# EAGLE design Akkucheck (EAGLE 7.3.0)
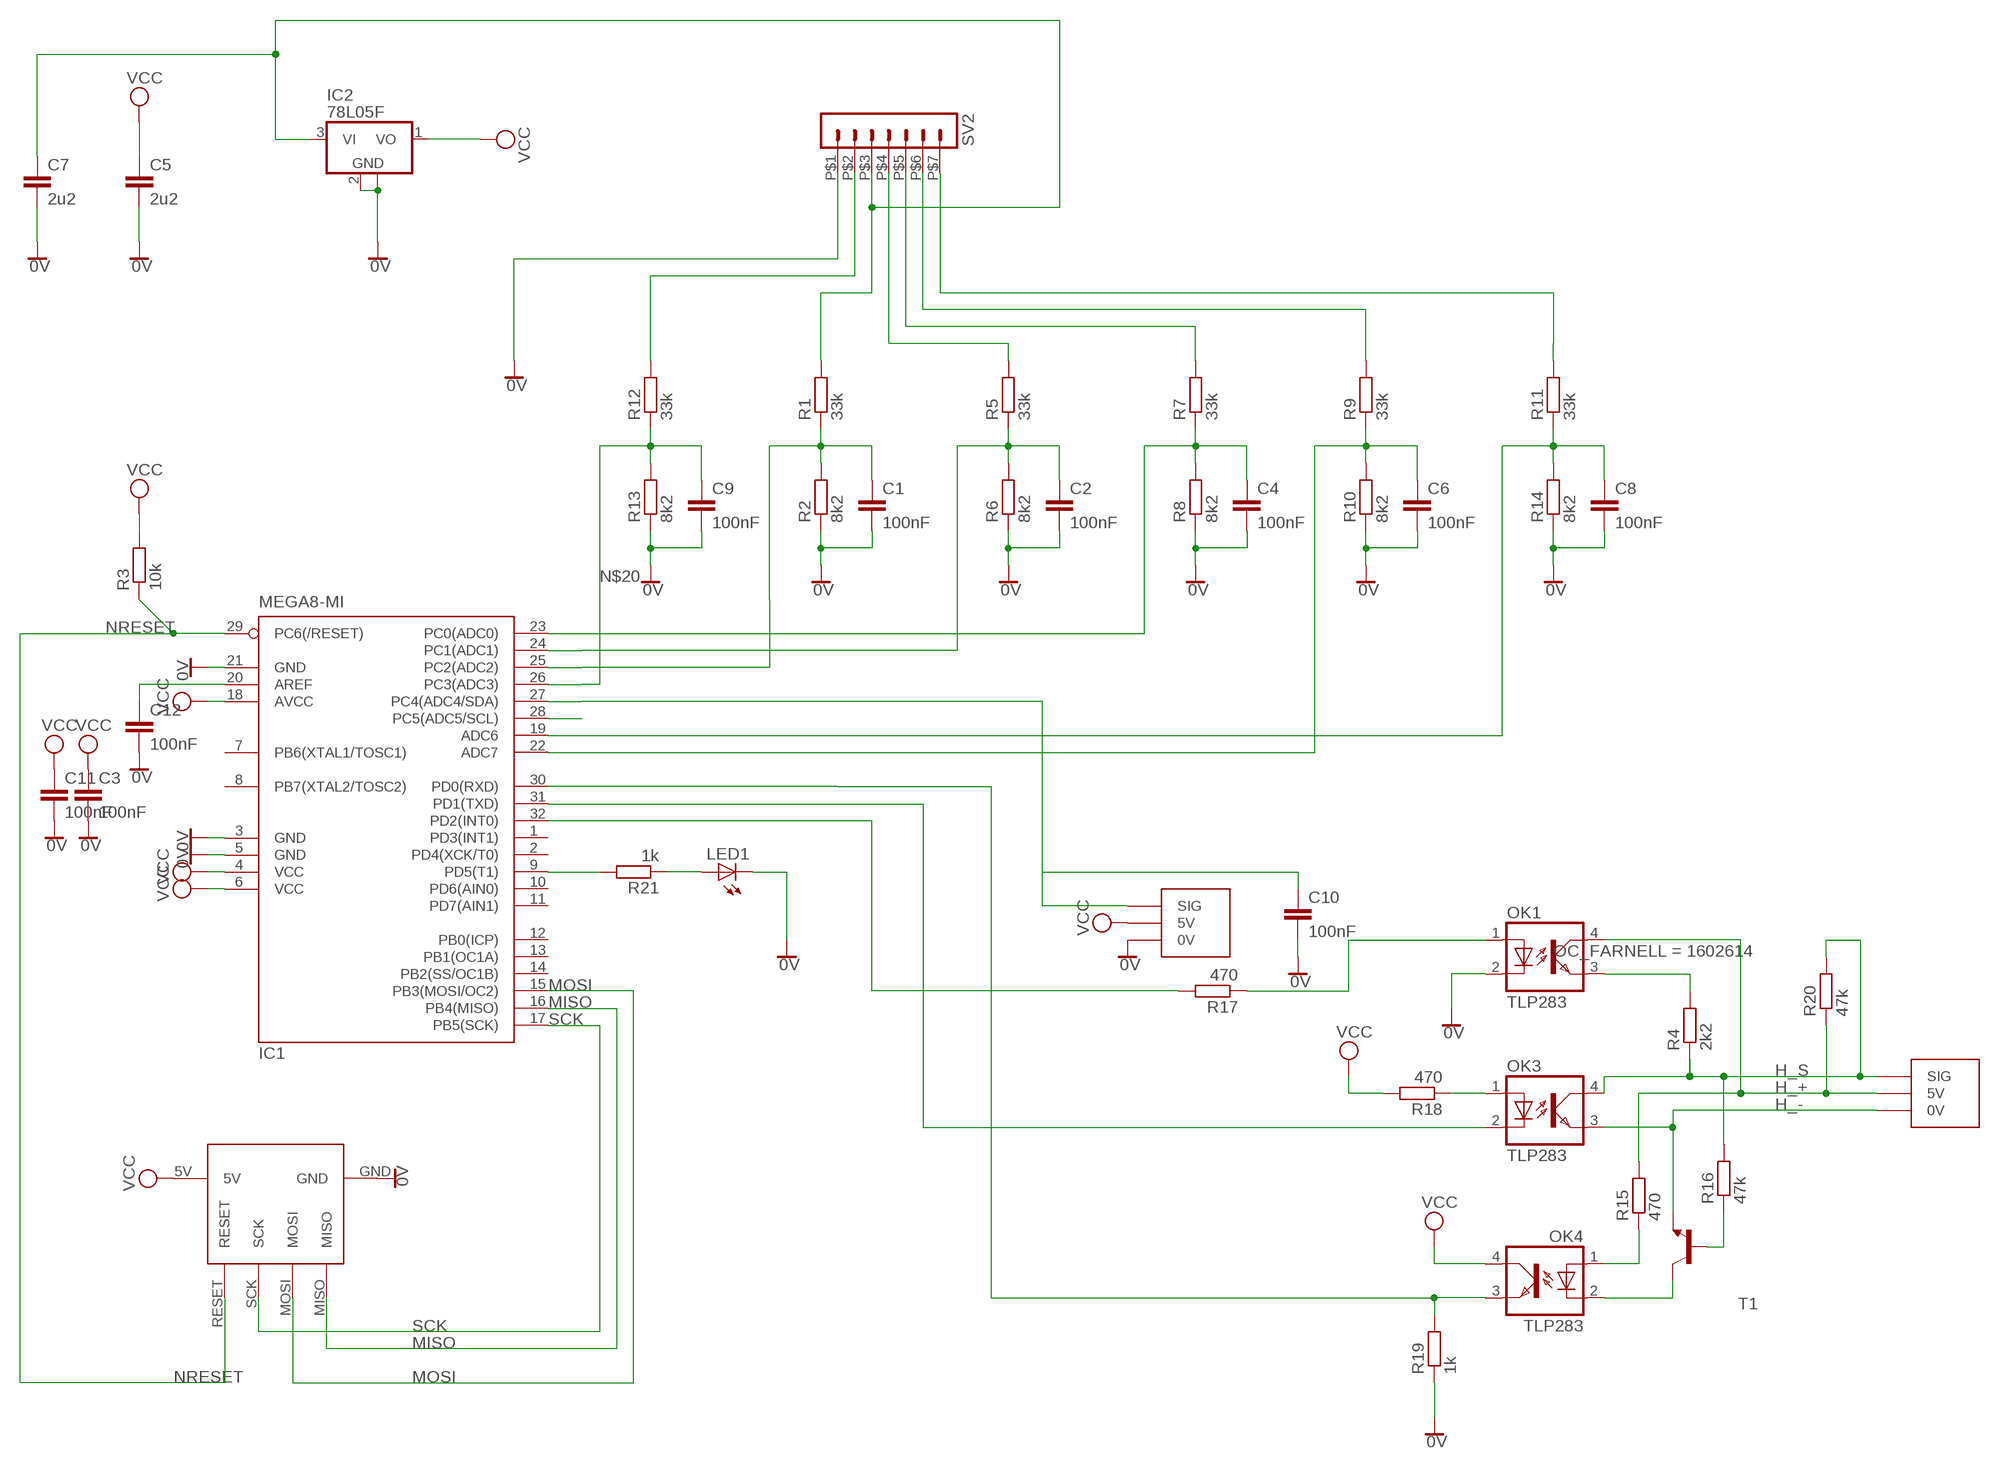
[diagram p0: schematic, sheet 1]

## Parts
C1  100nF  C-EUC0402  [C0402]
C2  100nF  C-EUC0402  [C0402]
C3  100nF  C-EUC0402  [C0402]
C4  100nF  C-EUC0402  [C0402]
C5  2u2  C-EUC0805  [C0805]
C6  100nF  C-EUC0402  [C0402]
C7  2u2  C-EUC0805  [C0805]
C8  100nF  C-EUC0402  [C0402]
C9  100nF  C-EUC0402  [C0402]
C10  100nF  C-EUC0402  [C0402]
C11  100nF  C-EUC0402  [C0402]
C12  100nF  C-EUC0402  [C0402]
IC1  MEGA8-MI  [MLF32]
IC2  78L05F  [SOT89]
IN1  3-WIRE_CONNWIRE  [3WIRE_CONN]
IN3  3-WIRE_CONNWIRE  [3WIRE_CONN]
LED1  LEDCHIPLED_0603  [CHIPLED_0603]
OK1  TLP283  [MINI-FLAT-4]
OK3  TLP283  [MINI-FLAT-4]
OK4  TLP283  [MINI-FLAT-4]
R1  33k  R-EU_R0402  [R0402]
R2  8k2  R-EU_R0402  [R0402]
R3  10k  R-EU_R0402  [R0402]
R4  2k2  R-EU_R0402  [R0402]
R5  33k  R-EU_R0402  [R0402]
R6  8k2  R-EU_R0402  [R0402]
R7  33k  R-EU_R0402  [R0402]
R8  8k2  R-EU_R0402  [R0402]
R9  33k  R-EU_R0402  [R0402]
R10  8k2  R-EU_R0402  [R0402]
R11  33k  R-EU_R0402  [R0402]
R12  33k  R-EU_R0402  [R0402]
R13  8k2  R-EU_R0402  [R0402]
R14  8k2  R-EU_R0402  [R0402]
R15  470  R-EU_R0402  [R0402]
R16  47k  R-EU_R0402  [R0402]
R17  470  R-EU_R0402  [R0402]
R18  470  R-EU_R0402  [R0402]
R19  1k  R-EU_R0402  [R0402]
R20  47k  R-EU_R0402  [R0402]
R21  1k  R-EU_R0402  [R0402]
SV2  MA07-1_SMD  [MA07-1_SMD]
T1  BC817-16-NPN-SOT23-BEC  [SOT23-BEC]
U$1  ISPSMD  [ISP_SMD]

## Nets
0V: C1.2 C2.2 C3.2 C4.2 C5.2 C6.2 C7.2 C8.2 C9.2 C10.2 C11.2 C12.2 IC1.3(GND) IC1.5(GND) IC1.21(GND) IC2.2(GND) IC2.2@1(GND) IN1.0V LED1.C OK1.2(C) R2.1 R6.1 R8.1 R10.1 R13.1 R14.1 R19.1 SV2.P$1 U$1.GND
H_+ [isol]: IN3.5V OK1.4(COL) R15.2 R20.1
H_- [isol]: IN3.0V OK3.3(EMIT) T1.E
H_S [isol]: IN3.SIG OK3.4(COL) R4.1 R16.2 R20.2
MISO: IC1.16(PB4(MISO)) U$1.MISO
MOSI: IC1.15(PB3(MOSI/OC2)) U$1.MOSI
N$1 [supp]: R12.2 SV2.P$2
N$2: C6.1 IC1.22(ADC7) R9.1 R10.2
N$3 [supp]: R5.2 SV2.P$4
N$4 [supp]: R7.2 SV2.P$5
N$5 [supp]: R9.2 SV2.P$6
N$6: C10.1 IC1.27(PC4(ADC4/SDA)) IN1.SIG
N$7 [supp]: C7.1 IC2.3(VI) R1.2 SV2.P$3
N$8: C8.1 IC1.19(ADC6) R11.1 R14.2
N$9: LED1.A R21.1
N$10: IC1.9(PD5(T1)) R21.2
N$11 [isol]: OK1.3(EMIT) R4.2
N$12 [isol]: OK4.1(A) R15.1
N$13 [isol]: OK4.2(C) T1.C
N$15: C1.1 IC1.25(PC2(ADC2)) R1.1 R2.2
N$16: C2.1 IC1.24(PC1(ADC1)) R5.1 R6.2
N$18: IC1.30(PD0(RXD)) OK4.3(EMIT) R19.2
N$19: IC1.31(PD1(TXD)) OK3.2(C)
N$20: C9.1 IC1.26(PC3(ADC3)) R12.1 R13.2
N$22 [isol]: R16.1 T1.B
N$23: OK3.1(A) R18.1
N$24: IC1.32(PD2(INT0)) R17.2
N$25: OK1.1(A) R17.1
N$26: C12.1 IC1.20(AREF)
N$27 [supp]: R11.2 SV2.P$7
N$28: IC1.28(PC5(ADC5/SCL))
N$33: C4.1 IC1.23(PC0(ADC0)) R7.1 R8.2
NRESET: IC1.29(PC6(/RESET)) R3.1 U$1.RESET
SCK: IC1.17(PB5(SCK)) U$1.SCK
VCC: C3.1 C5.1 C11.1 IC1.4(VCC) IC1.6(VCC) IC1.18(AVCC) IC2.1(VO) IN1.5V OK4.4(COL) R3.2 R18.2 U$1.5V
Unconnected: IC1.1(PD3(INT1)) IC1.2(PD4(XCK/T0)) IC1.7(PB6(XTAL1/TOSC1)) IC1.8(PB7(XTAL2/TOSC2)) IC1.10(PD6(AIN0)) IC1.11(PD7(AIN1)) IC1.12(PB0(ICP)) IC1.13(PB1(OC1A)) IC1.14(PB2(SS/OC1B))

## Library data of the parts
C1-C4 C6 C8-C12 = rcl:C-EU: CAPACITOR, European symbol; MF: AVX; MPN: 04023C104KAT2A; OC_FARNELL: 1867948
C5 C7 = rcl:C-EU: CAPACITOR, European symbol; MF: MULTICOMP; MPN: MC0805B225K250CT; OC_FARNELL: 2320829
IC1 = atmel:MEGA8: MICROCONTROLLER 8 Kbytes FLASH, 1 kbytes SRAM, 512 bytes EEPROM, USART, 6-channel 10 bit ADC, 2-channel 8 bit ADC Pin compatible with Atmega48, ATMega88, ATMega168 Source: avr.lbr; MF: ATMEL; MPN: ATMEGA88PA-MU; OC_FARNELL: 1715491; OC_NEWARK: 15R0272
IC2 = linear:78L*: POSITOIV-VOLTAGE REGULATORS Output up to 100 mA Source: http://focus.ti.com/lit/ds/symlink/ua78l05.pdf; MF: STMICROELECTRONICS; MPN: L78L05ABUTR; OC_FARNELL: 1467762
IN1 IN3 = Fabi:3-WIRE_CONN; OC_FARNELL: unknown
LED1 = led:LED: LED OSRAM: - CHIPLED LG R971, LG N971, LY N971, LG Q971, LY Q971, LO R971, LY R971 LH N974, LH R974 LS Q976, LO Q976, LY Q976 LO Q996 - Hyper CHIPLED LW Q18S LB Q993, LB Q99A, LB R99A - SideLED LS A670, LO A670, LY A670, LG A670, LP A670 LB A673, LV A673, LT A673, LW A673 LH A674 LY A675 LS A676, LA A676, LO A676, LY A676, LW A676 LS A679, LY A679, LG A679 - Hyper Micro SIDELED® LS Y876, LA Y876, LO Y876, LY Y876 LT Y87S - SmartLED LW L88C, LW L88S LB L89C, LB L89S, LG L890 LS L89K, LO L89K, LY L89K LS L896, LA L896, LO L896, LY L896 - TOPLED LS T670, LO T670, LY T670, LG T670, LP T670 LSG T670, LSP T670, LSY T670, LOP T670, LYG T670 LG T671, LOG T671, LSG T671 LB T673, LV T673, LT T673, LW T673 LH T674 LS T676, LA T676, LO T676, LY T676, LB T676, LH T676, LSB T676, LW T676 LB T67C, LV T67C, LT T67C, LS T67K, LO T67K, LY T67K, LW E67C LS E67B, LA E67B, LO E67B, LY E67B, LB E67C, LV E67C, LT E67C LW T67C LS T679, LY T679, LG T679 LS T770, LO T770, LY T770, LG T770, LP T770 LB T773, LV T773, LT T773, LW T773 LH T774 LS E675, LA E675, LY E675, LS T675 LS T776, LA T776, LO T776, LY T776, LB T776 LHGB T686 LT T68C, LB T68C - Hyper Mini TOPLED® LB M676 - Mini TOPLED Santana® LG M470 LS M47K, LO M47K, LY M47K Source: http://www.osram.convergy.de LUXEON: - LUMILED® LXK2-PW12-R00, LXK2-PW12-S00, LXK2-PW14-U00, LXK2-PW14-V00 LXK2-PM12-R00, LXK2-PM12-S00, LXK2-PM14-U00 LXK2-PE12-Q00, LXK2-PE12-R00, LXK2-PE12-S00, LXK2-PE14-T00, LXK2-PE14-U00 LXK2-PB12-K00, LXK2-PB12-L00, LXK2-PB12-M00, LXK2-PB14-N00, LXK2-PB14-P00, LXK2-PB14-Q00 LXK2-PR12-L00, LXK2-PR12-M00, LXK2-PR14-Q00, LXK2-PR14-R00 LXK2-PD12-Q00, LXK2-PD12-R00, LXK2-PD12-S00 LXK2-PH12-R00, LXK2-PH12-S00 LXK2-PL12-P00, LXK2-PL12-Q00, LXK2-PL12-R00 Source: www.luxeon.com KINGBRIGHT: KA-3528ASYC Source: www.kingbright.com; OC_FARNELL: unknown
OK1 OK3 OK4 = optocoupler:TLP283: TOSHIBA PHOTOCOUPLER GaAs IRED & PHOTO-TRANSISTOR Source: http://www.semicon.toshiba.co.jp/td/en/Opto/Photocoupler/en_20050928_TLP283_datasheet.pdf; MF: AVAGO TECHNOLOGIES; MPN: ACPL-217-500E; OC_FARNELL: 1602614; OC_NEWARK: unknown
R1 R5 R7 R9 R11 R12 = rcl:R-EU_: RESISTOR, European symbol; MF: TE CONNECTIVITY; MPN: CRG0402F33K; OC_FARNELL: 2331513
R2 R6 R8 R10 R13 R14 = rcl:R-EU_: RESISTOR, European symbol; MF: TE CONNECTIVITY; MPN: CRG0402F8K2; OC_FARNELL: 2331571
R3 = rcl:R-EU_: RESISTOR, European symbol; MF: VISHAY DRALORIC; MPN: CRCW040210K0FKEAHP; OC_FARNELL: 1738864
R4 = rcl:R-EU_: RESISTOR, European symbol; MF: PANASONIC ELECTRONIC COMPONENTS; MPN: ERJ2GEJ222X; OC_FARNELL: 2059231
R15 R17 R18 = rcl:R-EU_: RESISTOR, European symbol; MF: PANASONIC ELECTRONIC COMPONENTS; MPN: ERJ2GEJ470X; OC_FARNELL: 2059203
R16 R20 = rcl:R-EU_: RESISTOR, European symbol; MF: PANASONIC ELECTRONIC COMPONENTS; MPN: ERJ2GEJ473X; OC_FARNELL: 2059246
R19 R21 = rcl:R-EU_: RESISTOR, European symbol; MF: PANASONIC ELECTRONIC COMPONENTS; MPN: ERJ2GEJ102X; OC_FARNELL: 2059225
SV2 = Fab_con:MA07-1_SMD: PIN HEADER; OC_FARNELL: unknown; OC_NEWARK: unknown
T1 = transistor:*-NPN-: NPN Transistror BF959 corrected 2008.03.06; MF: NXP; MPN: BC817,215; OC_FARNELL: 1081223
U$1 = Fabian:ISP: ISP connector; OC_FARNELL: unknown

## Net classes
0 default: width 0.15 mm
1 supp: width 0.25 mm
2 isol: width 0.15 mm, clearance 0.5 mm to class 0, clearance 0.5 mm to class 1

## Board
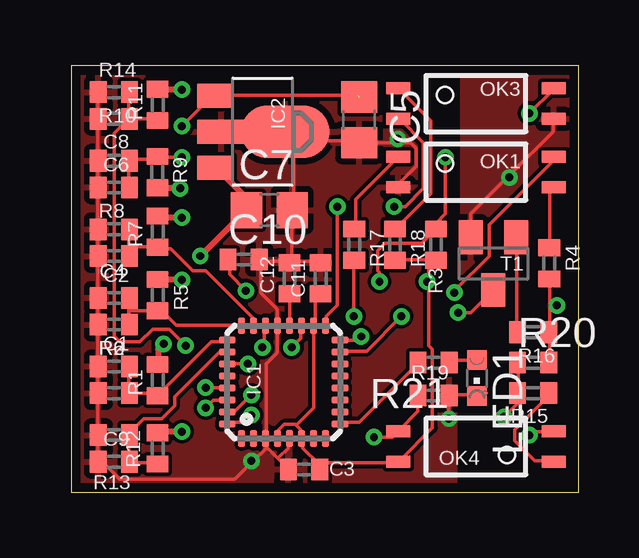
[diagram p1: board, top side]
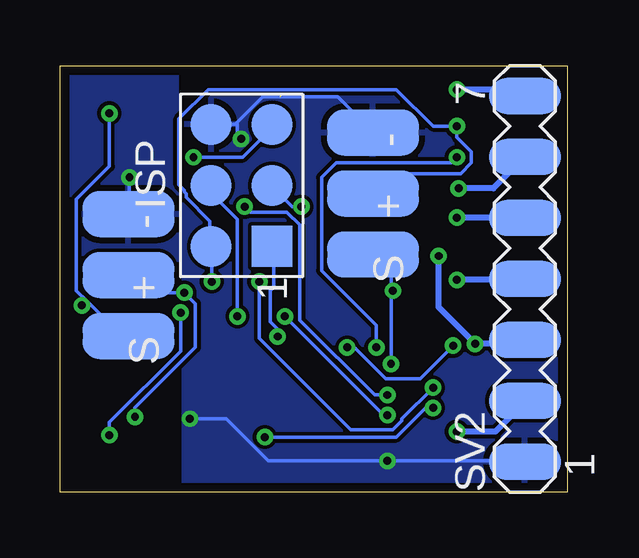
[diagram p2: board, bottom side, seen from below]

Size 21.15 x 17.78 mm. Coordinates in mm from the lower left corner, seen from the top.
Outline: 0,0 21.15,0 21.15,17.78 0,17.78 0,0
Copper layers (1*16): Top 0.0356mm / dielectric 1.5011mm / Bottom 0.0356mm
Design rules "OSHpark-LaenPCBOrder *": minimum track width 6mil, minimum drill 13mil, track to track 6mil, track to pad 6mil, pad to pad 6mil, via to via 6mil, smd to smd 6mil, copper to edge 15mil, drill to drill 6mil, minimum pad ring 7mil, minimum via ring 7mil, stop-mask expansion 3mil, vias tented up to drill 14mil, thermal gap 10mil
vRestrict: area 22.4,3.8 to 24.3,5.7

### Footprints (pad centres in the part's own frame; a part is rotated, then mirrored left to right if it is on the bottom)
C0402 = smd 0.7 x 0.9: 1 -0.65,0; 2 0.65,0
C0805 = smd 1.3 x 1.5: 1 -0.95,0; 2 0.95,0
MLF32 = smd 0.7 x 0.3: 1 -2.35,1.75; 2 -2.35,1.25; 3 -2.35,0.75; 4 -2.35,0.25; 5 -2.35,-0.25; 6 -2.35,-0.75; 7 -2.35,-1.25; 8 -2.35,-1.75; 17 2.35,-1.75; 18 2.35,-1.25; 19 2.35,-0.75; 20 2.35,-0.25; 21 2.35,0.25; 22 2.35,0.75; 23 2.35,1.25; 24 2.35,1.75 | smd 0.3 x 0.7: 9 -1.75,-2.35; 10 -1.25,-2.35; 11 -0.75,-2.35; 12 -0.25,-2.35; 13 0.25,-2.35; 14 0.75,-2.35; 15 1.25,-2.35; 16 1.75,-2.35; 25 1.75,2.35; 26 1.25,2.35; 27 0.75,2.35; 28 0.25,2.35; 29 -0.25,2.35; 30 -0.75,2.35; 31 -1.25,2.35; 32 -1.75,2.35
SOT89 = smd 1 x 1.5: 1 -1.499,-1.981; 3 1.499,-1.981 | smd 1 x 2: 2 0,-1.727 | smd 2.2 x 3.7: 2@1 0,0.94
3WIRE_CONN = smd 1.905 x 3.81: 0V -2.54,0; 5V 0,0; SIG 2.54,0
CHIPLED_0603 = smd 0.8 x 0.8: A 0,-0.75; C 0,0.75
MINI-FLAT-4 = smd 1 x 0.5: 1 -3.24,0.635; 2 -3.24,-0.635; 3 3.24,-0.635; 4 3.24,0.635
R0402 = smd 0.7 x 0.9: 1 -0.65,0; 2 0.65,0
MA07-1_SMD = smd 1.5 x 3: P$1 -7.62,0; P$2 -5.08,0; P$3 -2.54,0; P$4 0,0; P$5 2.54,0; P$6 5.08,0; P$7 7.62,0
SOT23-BEC = smd 1 x 1.4: B -0.95,-1.1; C 0,1.1; E 0.95,-1.1
ISP_SMD = smd 1.7 x 1.7: 5V -2.54,1.27; GND 2.54,1.27; MISO -2.54,-1.27; MOSI 0,1.27; RESET 2.54,-1.27; SCK 0,-1.27

### Placement (x,y rotation side)
C1  1.78,5.24 180 top
C2  1.78,8.1 180 top
C3  9.7,0.95 180 top
C4  1.78,10.95 180 top
C5  11.99,15.52 270 top
C6  1.78,12.7 180 top
C7  8.25,11.76 0 top
C8  1.78,15.56 180 top
C9  1.78,1.27 180 top
C10  7.18,9.69 0 top
C11  10.39,8.92 90 top
C12  9.09,8.92 90 top
IC1  8.85,4.59 90 top
IC2  7.98,15.02 270 top
IN1  8.11,12.45 270 bottom
IN3  18.29,9.04 270 bottom
LED1  16.9,4.76 180 top
OK1  16.86,13.34 0 top
OK3  16.86,16.19 0 top
OK4  16.86,1.9 180 top
R1  3.6,4.67 90 top
R2  1.78,4.13 0 top
R3  15.19,10.32 270 top
R4  19.91,9.54 90 top
R5  3.6,8.21 90 top
R6  1.78,6.99 0 top
R7  3.6,10.86 90 top
R8  1.78,9.84 0 top
R9  3.58,13.34 270 top
R10  1.78,13.81 0 top
R11  3.6,16.14 90 top
R12  3.6,1.83 90 top
R13  1.78,2.38 0 top
R14  1.78,16.67 0 top
R15  19.24,4.13 180 top
R16  19.24,6.67 0 top
R17  11.79,10.32 270 top
R18  13.49,10.32 270 top
R19  15.1,4.03 180 top
R20  19.24,5.4 0 top
R21  15.1,5.4 180 top
SV2  1.78,8.89 90 bottom
T1  17.59,9.53 180 top
U$1  13.58,12.79 90 bottom

### Tracks (layer width: path | path; a pad name or v marks a point on that pad's centre or on a via)
0V  (via drill 0.33)
  Top 0.152: LED1.C 16.88,4.05 15.81,4.05 R19.1 15.74,3.98 v15.74,3.06 | 1.1,15.56 1.1,16.62 R14.1 | 1.1,15.56 C8.2 1.1,15.56 | 1.1,9.84 1.1,10.91 C4.2 1.1,10.99 1.1,12.66 C6.2 1.1,12.74 1.1,13.8 R10.1 1.1,13.88 1.1,15.56 | 1.1,9.84 R8.1 1.1,9.84 | 1.1,4.13 1.1,5.19 C1.2 1.1,5.27 1.1,6.95 R6.1 1.1,7.02 1.1,8.09 C2.2 1.1,8.17 1.1,9.84 | 1.1,4.13 R2.1 1.1,4.13 | 1.1,4.13 1.1,2.45 R13.1 1.1,2.37 1.1,1.31 C9.2 1.18,1.23 1.33,1.23 2.02,0.55 6.82,0.55 7.54,1.27 | C5.2 13.6,14.57 | 13.6,14.57 14.14,14.57 14.36,14.34 14.36,13.58 13.68,12.89 13.68,12.74 OK1.2 | IC2.2 6.29,15.02 8.88,15.02 IC2.2@1 | 9.26,14.64 11.93,14.64 | 9.26,14.64 8.95,14.95 IC2.2@1 | 8.61,1.42 9.03,1 C3.2 | 8.61,1.42 8.15,1.88 | 8.15,1.88 8.12,1.92 8.12,2.22 IC1.3 8.12,2.3 8.12,5.35 8.57,5.8 8.57,6.87 IC1.21 8.57,6.95 8.57,7.63 7.89,8.32 7.89,9.61 | IC1.5 9.03,2.22 9.03,1.84 8.65,1.46 8.61,1.42 | 7.89,9.61 7.89,9.69 C10.2 7.89,9.61 | 7.89,9.61 9.03,9.61 C12.2 | 9.18,9.61 9.11,9.61 C12.2 | 9.18,9.61 10.33,9.61 C11.2 | 9.18,9.61 9.18,11.75 C7.2 9.26,11.82 9.26,14.64 | 9.18,9.61 C12.2 | 9.26,14.64 IC2.2@1 | 13.6,14.57 v13.6,14.72 | 7.54,1.27 8.12,1.84 8.15,1.88 | v7.51,1.31 7.54,1.27
  Bottom 0.152: v15.74,3.06 14.21,3.06 12.46,1.31 v7.51,1.31 1.79,1.31 SV2.P$1 | 13.79,15.37 12.69,16.47 9.56,16.47 8.12,15.02 IN1.0V | 13.79,15.37 13.83,15.33 14.82,15.33 U$1.GND | v13.6,14.72 13.75,14.87 13.75,15.33 13.79,15.37
  pour Bottom: 16.02,0 -0.44,0 -0.44,18.1 16.02,18.1
  pour Top: -0.44,18.1 16.02,18.1 16.02,0 -0.44,0
H_+  (via drill 0.33)
  Top 0.152: R20.1 18.63,5.35 18.63,4.13 R15.2 18.55,4.13 18.55,3.67 v18.02,3.14 | v15.96,8.32 15.96,8.39 17.41,9.84 17.41,11.14 20.08,13.8 20.08,13.96 OK1.4
  Bottom 0.152: IN3.5V 18.25,9 17.56,8.32 v15.96,8.32 15.51,7.86 15.51,6.03 18.02,3.52 v18.02,3.14
H_-  (via drill 0.33)
  Top 0.152: 18.21,13.16 16.65,11.6 16.65,10.68 T1.E | 18.21,13.16 20.08,15.02 20.08,15.56 OK3.3 | v18.25,13.12 18.21,13.16
  Bottom 0.152: v18.25,13.12 18.25,11.6 IN3.0V
  pour Top (rank 2): 22.4,18.1 16.27,18.1 16.27,0 22.4,0
  pour Bottom: 16.25,17.78 21.65,17.78 21.65,0 16.25,0
H_S  (via drill 0.33)
  Top 0.152: R20.2 19.93,5.42 19.93,6.64 R16.2 19.93,6.72 19.93,7.79 | 19.93,7.79 19.93,8.85 R4.1 | v19.09,15.79 20.08,16.78 OK3.4 | v20.23,7.79 19.93,7.79
  Bottom 0.152: v19.09,15.79 19.09,13.58 20.46,12.2 20.46,8.39 20.04,7.98 | 20.04,7.98 18.63,6.57 18.33,6.57 IN3.SIG | v20.23,7.79 20.08,7.94 20.04,7.98
MISO  (via drill 0.33)
  Top 0.152: v12.08,6.49 11.93,6.34 11.24,6.34 IC1.16
  Bottom 0.152: v12.08,6.49 12.08,6.79 12.38,7.1 12.38,8.39 12.23,8.55 12.23,10.15 12.31,10.22 U$1.MISO
MOSI  (via drill 0.33)
  Top 0.152: v13.75,7.33 12.31,5.88 11.24,5.88 IC1.15
  Bottom 0.152: v13.75,7.33 13.75,11.37 14.82,12.43 14.82,12.74 U$1.MOSI
N$1  (via drill 0.33)
  Top 0.25: v4.61,2.53 3.62,2.53 R12.2
  Bottom 0.25: v4.61,2.53 3.01,2.53 1.79,3.75 SV2.P$2
N$2  (via drill 0.33)
  Top 0.152: C6.1 2.4,12.74 2.4,13.8 R10.2 2.48,13.88 3.62,13.88 R9.1 3.62,13.96 v4.61,13.96 | v7.96,6.03 8.04,6.11 8.04,6.87 IC1.22
  Bottom 0.152: v7.96,6.03 7.96,6.95 10.25,9.23 10.25,13.12 9.64,13.73 4.84,13.73 v4.61,13.96
N$3  (via drill 0.33)
  Top 0.25: v4.61,8.85 3.62,8.85 R5.2
  Bottom 0.25: v4.61,8.85 1.79,8.85 SV2.P$4
N$4  (via drill 0.33)
  Top 0.25: v4.61,11.44 3.62,11.44 R7.2
  Bottom 0.25: v4.61,11.44 1.79,11.44 SV2.P$5
N$5  (via drill 0.33)
  Top 0.25: v4.53,12.66 3.62,12.66 R9.2
  Bottom 0.25: v4.53,12.66 3.09,12.66 SV2.P$6
N$6  (via drill 0.33)
  Top 0.152: v7.35,5.35 6.52,5.35 IC1.27 | v7.28,8.39 6.59,9.08 6.59,9.69 C10.1
  Bottom 0.152: 7.35,8.39 7.35,9.16 8.04,9.84 IN1.SIG | 7.35,8.39 v7.35,5.35 | 7.35,8.39 v7.28,8.39
N$7  (via drill 0.33)
  Top 0.25: IC2.3 6.06,13.5 7.28,12.28 7.28,11.82 C7.1 7.2,11.67 v5.37,9.84 | v3.85,6.18 3.62,5.96 3.62,5.35 R1.2
  Bottom 0.25: SV2.P$3 1.94,6.18 v3.85,6.18 3.92,6.26 5.37,7.71 v5.37,9.84
N$8  (via drill 0.33)
  Top 0.152: v9.18,6.03 9.56,6.41 9.56,6.87 IC1.19 | v4.76,6.11 4.08,6.79 3.39,6.79 2.86,6.26 2.02,6.26 1.79,6.49 1.79,14.95 2.4,15.56 | 2.4,15.56 C8.1 | 2.4,15.56 2.4,16.62 R14.2 | 2.4,15.56 C8.1 | R11.1 3.54,15.56 2.48,15.56 C8.1
  Bottom 0.152: v9.18,6.03 8.88,6.03 7.58,4.74 6.13,4.74 v4.76,6.11
N$9
  Top 0.152: LED1.A 16.88,5.5 15.89,5.5 15.81,5.42 R21.1
N$10
  Top 0.152: IC1.9 11.24,2.91 12,2.91 14.44,5.35 R21.2
N$11
  Top 0.152: R4.2 19.93,10.22 19.93,12.51 20.08,12.66 OK1.3
N$12
  Top 0.152: R15.1 19.85,4.13 19.85,3.98 18.48,2.6 18.48,2.15 19.32,1.31 20.08,1.31 OK4.1
N$13  (via drill 0.33)
  Top 0.152: v19.09,2.37 19.24,2.53 20.08,2.53 OK4.2 | v16.12,7.48 16.65,7.48 17.56,8.39 T1.C
  Bottom 0.152: v19.09,2.37 19.09,2.91 16.12,5.88 v16.12,7.48
N$15
  Top 0.152: C1.1 2.4,5.19 2.4,4.13 R2.2 2.48,4.13 3.62,4.13 R1.1 3.62,4.05 5.83,6.26 6.44,6.26 IC1.25
N$16
  Top 0.152: 2.4,7.56 2.4,8.09 C2.1 | 2.4,7.56 2.4,7.02 R6.2 | IC1.24 7.05,6.95 4.38,6.95 3.77,7.56 3.62,7.56 R5.1 3.54,7.56 2.4,7.56
N$18  (via drill 0.33)
  Top 0.152: v5.6,3.52 5.91,3.82 6.44,3.82 IC1.30 | v12.61,2.3 13.37,2.3 13.6,2.53 OK4.3 13.68,2.6 14.44,3.37 14.44,3.98 R19.2
  Bottom 0.152: v5.6,3.52 5.91,3.52 7.12,2.3 v12.61,2.3
N$19  (via drill 0.33)
  Top 0.152: v7.51,4.05 6.82,3.37 6.52,3.37 IC1.31 | v13.45,11.9 13.91,11.9 14.67,12.66 14.67,14.57 13.68,15.56 OK3.2
  Bottom 0.152: v7.51,4.05 8.04,4.05 11.16,7.18 11.16,11.14 11.7,11.67 13.22,11.67 v13.45,11.9
N$20
  Top 0.152: IC1.26 6.44,5.8 6.13,5.8 4.31,3.98 4.31,3.59 3.77,3.06 3.01,3.06 2.4,2.45 R13.2 2.4,2.37 2.4,1.31 C9.1 2.48,1.23 3.54,1.23 R12.1
N$22
  Top 0.152: R16.1 18.55,6.72 18.55,10.6 T1.B
N$23
  Top 0.152: R18.1 13.53,10.99 14.97,12.43 14.97,15.48 13.68,16.78 OK3.1
N$24  (via drill 0.33)
  Top 0.152: v7.51,3.21 7.2,2.91 6.52,2.91 IC1.32 | v11.77,7.33 11.77,9.61 R17.2
  Bottom 0.152: v7.51,3.21 7.66,3.21 v11.77,7.33
N$25
  Top 0.152: R17.1 11.85,10.99 11.85,12.2 13.6,13.96 OK1.1
N$26
  Top 0.152: IC1.20 9.11,8.24 C12.1
N$27  (via drill 0.33)
  Top 0.25: v4.61,16.78 3.62,16.78 R11.2
  Bottom 0.25: v4.61,16.78 2.02,16.78 1.79,16.55 SV2.P$7
N$33
  Top 0.152: 2.4,10.22 2.4,10.91 C4.1 | 2.4,10.22 2.4,9.84 R8.2 2.4,10.22 | IC1.23 7.58,6.95 7.58,7.25 5.6,9.23 5.07,9.23 4.15,10.15 3.62,10.15 R7.1 3.54,10.22 2.4,10.22
NRESET  (via drill 0.33)
  Top 0.152: v5.6,4.36 6.44,4.36 IC1.29 | v12.84,8.78 12.84,9.16 12.76,9.23 12.76,10.07 13.07,10.38 14.59,10.38 15.13,10.91 R3.1 15.2,10.99 15.2,11.21 15.58,11.6 v15.58,13.96
  Bottom 0.152: v5.6,4.36 6.9,3.06 6.9,2.98 7.28,2.6 9.03,2.6 12.84,6.41 v12.84,8.78 | v15.58,13.96 13.53,13.96 12.38,15.1 12.38,15.25 U$1.RESET
SCK  (via drill 0.33)
  Top 0.152: v11.09,11.9 11.09,7.79 10.63,7.33 10.63,6.95 IC1.17
  Bottom 0.152: v11.09,11.9 11.47,11.9 12.31,12.74 U$1.SCK
VCC  (via drill 0.33)  (1 unrouted)
  Top 0.152: 11.93,16.55 6.06,16.55 IC2.1 5.98,16.47 5.83,16.47 v4.61,15.25 | 14.9,9.69 15.13,9.69 R3.2 14.9,9.69 | 14.9,9.69 13.53,9.69 R18.2 | C11.1 10.33,8.24 10.17,8.09 10.17,6.95 IC1.18 10.1,6.87 10.1,3.52 9.41,2.83 9.37,2.79 | 9.37,2.79 9.56,2.6 9.56,2.3 IC1.6 9.64,2.22 9.64,1.84 10.33,1.16 10.33,1 C3.1 10.33,1.23 13.6,1.23 OK4.4 13.68,1.31 15.05,2.68 15.05,5.96 14.9,6.11 14.9,8.78 | 9.37,2.79 9.33,2.83 8.88,2.83 8.65,2.6 8.65,2.3 IC1.4 | 14.9,8.78 14.9,9.69 | 14.9,8.78 v14.82,8.78
  Bottom 0.152: IN1.5V 8.04,12.51 7.28,13.27 4.46,13.27 4,13.73 4,14.19 4.61,14.8 v4.61,15.25 5.6,15.25 7.12,16.78 14.97,16.78 16.19,15.56 16.19,12.81 15.96,12.59 15.96,12.51 15.89,12.43 15.89,12.28 14.9,11.29 14.9,10.3 U$1.5V 14.82,10.22 v14.82,8.78